# Altium schematic sheet SH2 - 5V VICOR DCDC.SchDoc: 5V Vicor Power Supply
size Letter; DrawnBy: Adrianna Ascalon; Organization: UW Robotics; Address1: 200 University Avenue; Address2: Waterloo; Address3: Ontario; Address4: Canada N2L 3G6; SheetNumber: 2; SheetTotal: 3
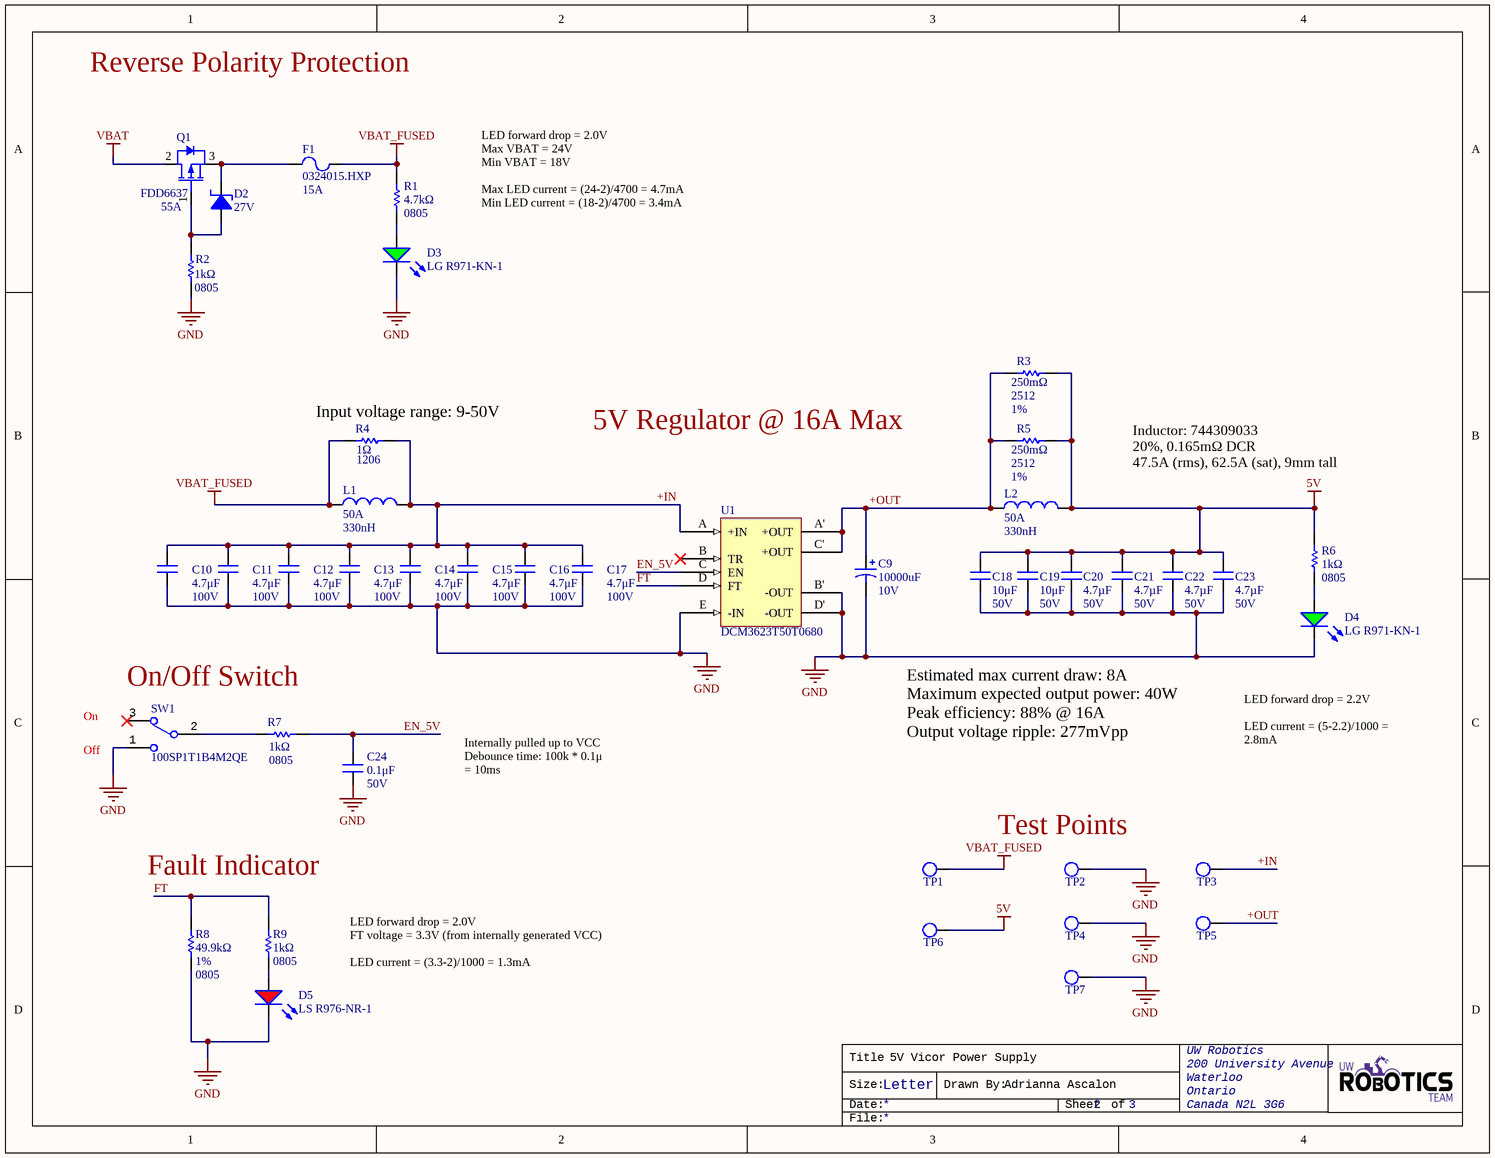
[diagram p0: SH2 - 5V VICOR DCDC.SchDoc]

## Parts
C9  Capacitance: 10000uF  Voltage Rating: 10V  [CAP_UBY_18X25_NC]  (hidden comment: URS1A103MHD1TN)
C10  4.7μF  Voltage Rating: 100V  [CAPC5750X7R2A]
C11  4.7μF  Voltage Rating: 100V  [CAPC5750X7R2A]
C12  4.7μF  Voltage Rating: 100V  [CAPC5750X7R2A]
C13  4.7μF  Voltage Rating: 100V  [CAPC5750X7R2A]
C14  4.7μF  Voltage Rating: 100V  [CAPC5750X7R2A]
C15  4.7μF  Voltage Rating: 100V  [CAPC5750X7R2A]
C16  4.7μF  Voltage Rating: 100V  [CAPC5750X7R2A]
C17  4.7μF  Voltage Rating: 100V  [CAPC5750X7R2A]
C18  value 10μF  Voltage Rating: 50V  [CAPC1206(3216)]  (hidden comment: 10uF)
C19  value 10μF  Voltage Rating: 50V  [CAPC1206(3216)]  (hidden comment: 10uF)
C20  4.7µF  Voltage: 50V  [CAPC1206(3216)]
C21  4.7µF  Voltage: 50V  [CAPC1206(3216)]
C22  4.7µF  Voltage: 50V  [CAPC1206(3216)]
C23  4.7µF  Voltage: 50V  [CAPC1206(3216)]
C24  0.1μF  Voltage Rating: 50V  [CAPC2012X140N]
D2  Working Voltage: 27V  [SOT23-3]  (hidden comment: DIO_ZENER_27V)
D3  LG R971-KN-1  [LED_0805_LINE]
D4  LG R971-KN-1  [LED_0805_LINE]
D5  LS R976-NR-1  [LED_0805_LINE]
F1  0324015.HXP  Current Rating: 15A  [FUSE]
L1  Max DC Current: 50A  Inductance: 330nH  [WE-HCM 1390]  (hidden comment: 744309033)
L2  Max DC Current: 50A  Inductance: 330nH  [WE-HCM 1390]  (hidden comment: 744309033)
Q1  Continuous Drain Current (ID): 55A  [D-PAK]  (hidden comment: FDD6637)
R1  value 4.7kΩ  Case Code (Imperial): 0805  [RESC2012X60N]  (hidden comment: RES_4.7kΩ_0805)
R2  1kΩ  Case Code (Imperial): 0805  [RESC2012X60N]
R3  Package Reference: 2512  Resistance Tolerance: 1%  Resistance: 250mΩ  [RESC6432X89X76NL25T25]  (hidden comment: WSL2512R2500FEA)
R4  Case Code (Imperial): 1206  Resistance: 1Ω  [RESC1206(3216)_N]  (hidden comment: RES_1Ω_1206)
R5  Package Reference: 2512  Resistance Tolerance: 1%  Resistance: 250mΩ  [RESC6432X89X76NL25T25]  (hidden comment: WSL2512R2500FEA)
R6  1kΩ  Case Code (Imperial): 0805  [RESC2012X60N]
R7  1kΩ  Case Code (Imperial): 0805  [RESC2012X60N]
R8  49.9kΩ  Tolerance: 1%  Case Code (Imperial): 0805  [RESC2012X60N]
R9  1kΩ  Case Code (Imperial): 0805  [RESC2012X60N]
SW1  100SP1T1B4M2QE  [100SP1T1B4M2QE]
TP1  TESTPOINT_LOOP  [TESTPOINT_LOOP]  (value not drawn)
TP2  TESTPOINT_LOOP  [TESTPOINT_LOOP]  (value not drawn)
TP3  TESTPOINT_LOOP  [TESTPOINT_LOOP]  (value not drawn)
TP4  TESTPOINT_LOOP  [TESTPOINT_LOOP]  (value not drawn)
TP5  TESTPOINT_LOOP  [TESTPOINT_LOOP]  (value not drawn)
TP6  TESTPOINT_LOOP  [TESTPOINT_LOOP]  (value not drawn)
TP7  TESTPOINT_LOOP  [TESTPOINT_LOOP]  (value not drawn)
U1  DCM3623T50T0680  [DCM3623T50T0680]

## Nets
5V: C18.2 C19.2 C20.2 C21.2 C22.2 C23.2 L2.2 R3.2 R5.2 R6.2 TP6.1
GND: C9.2 C10.1 C11.1 C12.1 C13.1 C14.1 C15.1 C16.1 C17.1 C18.1 C19.1 C20.1 C21.1 C22.1 C23.1 C24.1 D3.2(K) D4.2(K) D5.2(K) R2.1 R8.2 SW1.1 TP2.1 TP4.1 TP7.1 U1.B'(-OUT) U1.D'(-OUT) U1.E(-IN)
VBAT: Q1.2(Drain)
VBAT_FUSED: F1.2 L1.1 R1.2 R4.1 TP1.1
+IN: C10.2 C11.2 C12.2 C13.2 C14.2 C15.2 C16.2 C17.2 L1.2 R4.2 TP3.1 U1.A(+IN)
+OUT: C9.1 L2.1 R3.1 R5.1 TP5.1 U1.A'(+OUT) U1.C'(+OUT)
EN_5V: C24.2 R7.2 U1.C(EN)
FT: R8.1 R9.2 U1.D(FT)
NetD2_1: D2.1(Anode) Q1.1(Gate) R2.2
NetD2_2: D2.2(Cathode) F1.1 Q1.3(Source)
NetD3_1: D3.1(A) R1.1
NetD4_1: D4.1(A) R6.1
NetD5_1: D5.1(A) R9.1
NetR7_1: R7.1 SW1.2

Not connected (* = marked no-connect by the designer): SW1 3*; U1 B(TR)*

## Notes on the sheet
- Reverse Polarity Protection
- LED forward drop = 2.0V
  Max VBAT = 24V
  Min VBAT = 18V
  Max LED current = (24-2)/4700 = 4.7mA
  Min LED current = (18-2)/4700 = 3.4mA
- (near R4) Input voltage range: 9-50V
- 5V Regulator @ 16A Max
- Inductor: 744309033
  20%, 0.165mΩ DCR
  47.5A (rms), 62.5A (sat), 9mm tall
- On/Off Switch
- (near SW1) Off
- On
- Internally pulled up to VCC
  Debounce time: 100k * 0.1μ = 10ms
- Estimated max current draw: 8A
  Maximum expected output power: 40W
  Peak efficiency: 88% @ 16A
  Output voltage ripple: 277mVpp
- LED forward drop = 2.2V
  LED current = (5-2.2)/1000 = 2.8mA
- (near TP2) Test Points
- Fault Indicator
- LED forward drop = 2.0V
  FT voltage = 3.3V (from internally generated VCC)
  LED current = (3.3-2)/1000 = 1.3mA
- Title
- Size:
- Date:
- Letter
- Drawn By:
- Sheet
- of
- File:

## Library data of the parts
C9 = URS1A103MHD1TN: CAP ALUM 10000UF 20% 10V RADIAL; Manufacturer 1: Nichicon; Ripple Current: 2.35A; Life (Hours): 2000Hour; Supplier 1: Digi-Key; Manufacturer Part Number 1: URS1A103MHD1TN; Mount: Through Hole; Case/Package: Radial; Min Operating Temperature: -40°C; Max Operating Temperature: 85°C; Tolerance: 20%; Lead Pitch: 0.295inch; Height - Seated (Max): 1.043inch; Supplier Part Number 1: 493-12364-1-ND
C10-C17 = CAP_4.7uF_100V_2220: CAP CER 4.7UF 100V X7R 2220; Manufacturer: TDK; Manufacturer Part Number: C5750X7R2A475M230KA; Tolerance: 20%; Supplier Part Number 1: 445-1450-1-ND; Supplier 1: Digi-Key; Category: Ceramic Capacitors; Mount: Surface Mount; Number of Pins: 2; Weight: 0.016932oz; Case Code (Metric): 5750; Case Code (Imperial): 2220; Min Operating Temperature: -55°C; Max Operating Temperature: 125°C; Termination: SMD/SMT; Voltage: 100V; Voltage Rating (DC): 100V; Dielectric: X7R; Composition: Ceramic; Length: 5.7mm; Height: 2.3mm; Depth: 5mm; Width: 0.197inch; Thickness: 0.098inch; REACH SVHC: No SVHC; Capacitor Value: 4.7μF; Package: 2220 (5750 Metric); Value: 4.7μF
C18 C19 = CAP_10uF_50V_1206: CAP CER 10UF 50V X5R 1206; Manufacturer Part Numer 1: GRT31CR61H106KE01L; Manufacturer 1: Murata; Dimensions: 0.126" L x 0.063" W (3.20mm x 1.6mm); Package: 1206 (3216 Metric); Supplier Part Number 1: 490-12456-1-ND; Supplier 1: Digi-Key; Mount: Surface Mount; Case Code (Imperial): 1206; Case Code (Metric): 3216; Dielectric: X5R; Manufacturer Part Number 1: GRT31CR61H106KE01L
C20-C23 = CAP_4.7µF_50V_1206: CAP CER 4.7UF 50V X7R 1206; Manufacturer 1: Murata; Manufacturer Part Number 1: GRM31CR71H475KA12L; Material: Ceramic; Tolerance: 10%; Capacitance: 4.7uF; Voltage Rating: 50V; Supplier 1: Digi-Key; Mount: Surface Mount; Case Code (Metric): 3216; Case Code (Imperial): 1206; Min Operating Temperature: -55°C; Max Operating Temperature: 125°C; Voltage Rating (DC): 50V; Termination: SMD/SMT; Dielectric: X7R; Length: 3.2mm; Height: 1.6mm; Width: 0.063inch; Thickness: 0.071inch; Depth: 1.6mm; REACH SVHC: No SVHC; ComponentLink7URL: https://datasheet.ciiva.com/6270/partnumbering-e-01-6270217.pdf?src-supplier=Digi-Key; ComponentLink7Description: https://datasheet.ciiva.com/6270/partnumbering-e-01-6270217.pdf?src-supplier=Digi-Key; ComponentLink8URL: https://datasheet.ciiva.com/6270/partnumbering-e-01-6270218.pdf?src-supplier=Digi-Key; ComponentLink8Description: https://datasheet.ciiva.com/6270/partnumbering-e-01-6270218.pdf?src-supplier=Digi-Key; Supplier Part Number 1: 490-6521-1-ND; Package: 1206 (3216 Metric)
C24 = CAP_0.1uF_50V_0805: CAP CER 0.1UF 50V X7R 0805; Manufacturer Part Number 1: GCD21BR71H104KA01L; Manufacturer 1: Murata Electronics; Tolerance: 10%; Package: 0805 (2012 Metric); Supplier Part Number 1: 490-11955-1-ND; Supplier 1: Digi-Key; Mount: Surface Mount; Value: 0.1μF; Case Code (Imperial): 0805; Case Code (Metric): 2012; Dielectric: X7R; Min Operating Temperature: -55°C; Max Operating Temperature: 125°C; Termination: SMD/SMT; Length: 2mm; Height: 1.25mm; Width: 0.049inch; Thickness: 0.049inch; Depth: 1.25mm; Ratings: AEC-Q200
D2 = DIO_ZENER_27V: DIODE ZENER 27V 250MW SOT23; Manufacturer 1: Nexperia USA Inc.; Manufacturer Part Number 1: BZX84-C27,215; Tolerance: 5%; Forward Voltage: 0.9V; Supplier Part Number 1: 1727-5026-2-ND; Supplier 1: Digi-Key; Mount: Surface Mount; Package/Case: SOT-23-3
D3 D4 = DIO_LED_G: LED GREEN DIFFUSED 0805 SMD; Manufacturer 1: OSRAM; Forward Voltage Drop: 2.2V; Package: 0805 (2012 Metric); Manufacturer Part Number 1: LG R971-KN-1; Supplier Part Number 1: 475-1410-1-ND; Supplier 1: Digi-Key; Mount: Surface Mount
D5 = DIO_LED_R: LED RED DIFFUSED 0805 SMD; Manufacturer 1: OSRAM; Forward Voltage Drop: 2V; Package: 0805 (2012 Metric); Manufacturer Part Number 1: LS R976-NR-1; Supplier Part Number 1: 475-1278-1-ND; Supplier 1: Digi-Key; Mount: Surface Mount
F1 = 0324015.HXP: FUSE CERM 15A 250VAC 125VDC 3AB; Manufacturer 1: Littelfuse; Fuse Type: Cartridge, Ceramic; Voltage Rating (DC): 125V; Voltage Rating (AC): 250V; DC Cold Resistance: 5.05mR; Approvals: UL,CSA,CE,K-Mark; Supplier 1: Digi-Key; Manufacturer Part Number 1: 0324015.HXP; Mount: Through Hole; Case/Package: Axial; Housing Material: Ceramic; Min Operating Temperature: -55°C; Max Operating Temperature: 125°C; Termination: Axial; Fuse Current: 15A; Resistance: 5.05mR; Working Voltage: 250V; Diameter: 6.985mm; Length: 1.288inch; REACH SVHC: Unknown; Supplier Part Number 1: F1870-ND
L1 L2 = 744309033: IND 330NH 47.5A 0.165 MOHM; Manufacturer 1: Wurth Electronics; Core Material: Zinc; Inductance Tolerance: 20%; Self Resonant Frequency: 158MHz; Saturation Current: 62.5A; Shielding: Shielded; DC Resistance (DCR): 0.165mR; Test Frequency: 100kHz; Supplier 1: Newark; Manufacturer Part Number 1: 744309033; Mount: Surface Mount; Case/Package: Nonstandard; Min Operating Temperature: -40°C; Max Operating Temperature: 125°C; Current Rating: 47.5A; Tolerance: 20%; Composition: Wirewound; Termination: SMD/SMT; RMS Current (Irms): 50A; Length: 0.551inch; Height: 9mm; Width: 0.512inch; Height - Seated (Max): 0.374inch; REACH SVHC: Unknown
Q1 = FDD6637: MOSFET P-CH 35V 13A DPAK; Manufacturer 1: ON Semiconductor / Fairchild; Rds On Max: 11.6mR; Input Capacitance: 2.37nF; Max Power Dissipation: 57W; Rise Time: 10ns; Fall Time: 36ns; Turn-Off Delay Time: 62ns; Turn-On Delay Time: 18ns; Gate to Source Voltage (Vgs): 25V; Element Configuration: Single; Number of Elements: 1; Power Dissipation: 3.1W; Drain to Source Breakdown Voltage: -35V; Threshold Voltage: -1.6V; Supplier 1: Digi-Key; Mount: Surface Mount; Case/Package: TO-252; Number of Pins: 3; Weight: 0.26037g; Min Operating Temperature: -55°C; Max Operating Temperature: 150°C; Drain to Source Voltage (Vdss): 35V; Drain to Source Resistance: 11.6mR; Nominal Vgs: -1.6V; On-State Resistance: 11.6MR; Length: 6.73mm; Height: 2.39mm; Width: 6.22mm; REACH SVHC: No SVHC; ComponentLink7URL: https://datasheet.ciiva.com/28548/686553-28548172.pdf?src-supplier=Element14; ComponentLink7Description: https://datasheet.ciiva.com/28548/686553-28548172.pdf?src-supplier=Element14; ComponentLink8URL: https://datasheet.ciiva.com/6382/fdd6637-6382456.pdf?src-supplier=Digi-Key; ComponentLink8Description: https://datasheet.ciiva.com/6382/fdd6637-6382456.pdf?src-supplier=Digi-Key; ComponentLink9URL: https://datasheet.ciiva.com/6382/fdd6637-6382457.pdf?src-supplier=Digi-Key; ComponentLink9Description: https://datasheet.ciiva.com/6382/fdd6637-6382457.pdf?src-supplier=Digi-Key; Supplier Part Number 1: FDD6637CT-ND; Manufacturer Part Number 1: FDD6637
R1 = RES_4.7kΩ_0805: RES SMD 4.7K OHM 5% 1/8W 0805; Manufacturer 1: Yageo; Manufacturer Part Number 1: RC0805JR-074K7L; Resistance: 4.7kR; Temperature Coefficient: 100ppm/°C; Power Rating: 125mW; Voltage Rating: 150V; Supplier 1: Digi-Key; Contact Plating: Tin,Lead,Matte; Case Code (Metric): 2012; Min Operating Temperature: -55°C; Max Operating Temperature: 155°C; Tolerance: 5%; Composition: Thick Film; Termination: SMD/SMT; Military Standard: Not; Length: 2mm; Depth: 1.25mm; REACH SVHC: Unknown; Supplier Part Number 1: 311-4.7KARCT-ND; Mount: Surface Mount; Package: 0805 (2012 Metric)
R2 R6 R9 = RES_1kΩ_0805: RES SMD 1K OHM 1% 1/8W 0805; Manufacturer 1: Yageo; Manufacturer Part Number 1: RC0805FR-071KL; Power Rating: 125mW; Temperature Coefficient: 25ppm/°C; Voltage Rating: 150V; Package: 0805 (2012 Metric); Supplier Part Number 1: 311-1.00KCRCT-ND; Supplier 1: Digi-Key; Case Code (Metric): 2012; Tolerance: 1%; Value: 1kΩ; Min Operating Temperature: -55°C; Max Operating Temperature: 155°C; Resistance: 1K; Termination: SMD/SMT; Mount: Surface Mount; Case/Package: 0805; Number of Pins: 2; Weight: 0.000194oz; Contact Plating: Tin; Composition: Thin Film; Number of Terminations: 2; Voltage Rating (DC): 150V; Max Power Dissipation: 125mW; Features: Moisture Resistant,Automotive AEC-Q200,Anti-Sulfur; Military Standard: Not; Length: 2mm; Height: 0.022inch; Width: 0.049inch; Depth: 1.25mm; REACH SVHC: Unknown
R3 R5 = RES_250mΩ_2512: RES 0.25 OHM 1% 1W 2512; Manufacturer: Vishay; Automotive Qualification Standard: AEC-Q200; Temperature Coefficient: ±75ppm/°C; Resistor Case Style: 2512[6432Metric]; SVHC: NoSVHC(15-Jun-2015); Product Range: WSLSeries; Resistor Element Type: MetalStrip; Power Rating: 1W; Manufacturer URL: http://www.vishay.com/; Datasheet Version: 07/2016; Datasheet URL: http://www.vishay.com/docs/30100/wsl.pdf; Mounting Technology: SurfaceMount; MSL: MSL1-Unlimited; Package Description: 2-Pin Surface Mount Device, Body 6.35 x 3.18 mm; Case Code (Imperial): 2512; Case Code (Metric): 6432; Package: 2512 (6432 Metric)
R4 = RES_1Ω_1206: RES 1 OHM 5% 1/4W 1206; Manufacturer: KOA Speer; Manufacturer Part Number: RK73B2BTTE1R0J; Power Rating: 250mW; Voltage Rating: 200V; Temperature Coefficient: 200ppm/°C; Supplier 1: Digi-Key; Category: Chip SMD Resistors; Case Code (Metric): 3216; Min Operating Temperature: -55°C; Max Operating Temperature: 155°C; Tolerance: 5%; Termination: SMD/SMT; Composition: Thick Film; Length: 3.2mm; Height: 0.6mm; Width: 1.6mm; Supplier Part Number 1: 2019-RK73B2BTTE1R0JCT-ND; Package: 1206 (3216 Metric)
R7 = RES_100kΩ_0805: RES SMD 100K OHM 0.5% 1/8W 0805; Manufacturer 1: Panasonic; Manufacturer Part Number 1: ERA-6AED104V; Resistance: 100kΩ; Power Rating: 125mW; Temperature Coefficient: 25ppm/°C; Voltage Rating: 200V; Package: 0805 (2012 Metric); Supplier Part Number 1: P123795CT-ND; Supplier 1: Digi-Key; Case Code (Metric): 2012; Tolerance: 0.5%; Min Operating Temperature: -55°C; Max Operating Temperature: 155°C; Termination: SMD/SMT; Mount: Surface Mount; Contact Plating: Tin; Composition: Thin Film; Military Standard: Not; Length: 2mm; Height: 0.5mm; Width: 1.25mm; Depth: 1.25mm; Category: Chip SMD Resistors
R8 = RES_49.9kΩ_0805: RES SMD 49.9K OHM 1% 1/8W 0805; Manufacturer Part Number 1: TNPW080549K9BEEN; Manufacturer 1: Vishay Dale; Power Rating: 125mW; Voltage Rating: 150V; Temperature Coefficient: 25ppm/°C; Resistance: 49.9kR; Supplier 1: Digi-Key; Mount: Surface Mount; Number of Pins: 2; Min Operating Temperature: -55°C; Max Operating Temperature: 125°C; Composition: Thin Film; Termination: SMD/SMT; Military Standard: Not; Voltage Rating (DC): 150V; Length: 2mm; Height: 0.022inch; Width: 0.049inch; Supplier Part Number 1: 541-3802-1-ND; Package: 0805 (2012 Metric); Case Code (Metric): 2012; Depth: 1.25mm; Weight: 0.000194oz; Contact Plating: Tin; Number of Terminations: 2; Max Power Dissipation: 125mW; Features: Moisture Resistant,Automotive AEC-Q200,Anti-Sulfur; REACH SVHC: Unknown
SW1 = SW_SPDT: SWITCH TOGGLE SPDT 5A 120V; Manufacturer 1: E-Switch; Actuator Material: Brass,Chrome; Electrical Life: 40000Cycles; Actuator Type: Standard Round; Voltage Rating (DC): 28V; Illumination Type: Non-Illuminated,Illuminated; Switch Function: On-On; Actuator Length: 12.19mm; Supplier 1: Digi-Key; Manufacturer Part Number 1: 100SP1T1B4M2QE; Mount: Through Hole; Contact Material: Silver; Contact Plating: Silver; Min Operating Temperature: -30°C; Max Operating Temperature: 85°C; Termination: PC Pin; Throw Configuration: SPDT; Orientation: Vertical; Voltage Rating (AC): 120V; Supplier Part Number 1: EG2355-ND; Current Rating: 5A
TP1-TP7 = TESTPOINT_LOOP: PC TEST POINT MINIATURE WHITE; Manufacturer 1: Keystone Electronics; Manufacturer Part Number 1: 5002; Supplier Part Number 1: 36-5002-ND; Supplier 1: Digi-Key; Mount: Through Hole
U1 = DCM3623T50T0680: DC DC CONVERTER 5V 80W